# Altium schematic sheet Model2_v1.0.SchDoc
size 71 x 38 mm
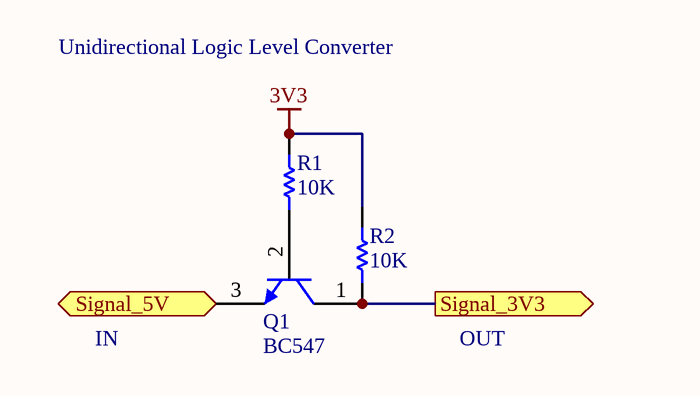
[diagram p0: Model2_v1.0.SchDoc]

## Parts
Q1  BC547  [TO92_3Pin]
R1  10K  [SMD_0805]
R2  10K  [SMD_0805]

## Ports
Signal_3V3 (out), Signal_5V (in)

## Nets
3V3: R1.2 R2.2
Signal_3V3: Q1.1(C) R2.1 ; port Signal_3V3
Signal_5V: Q1.3(E) ; port Signal_5V
NetQ1_2: Q1.2(B) R1.1

## Notes on the sheet
- (near R1) Unidirectional Logic Level Converter
- IN
- OUT

## Library data of the parts
Q1 = Transistor_BJT_NPN_cbe: Transistor, BJT, NPN; Package Reference: TO-92A
R1 R2 = Resistor: Resistor, 1/4W, 5%; Revision: July-2002: Re-released for DXP Platform.